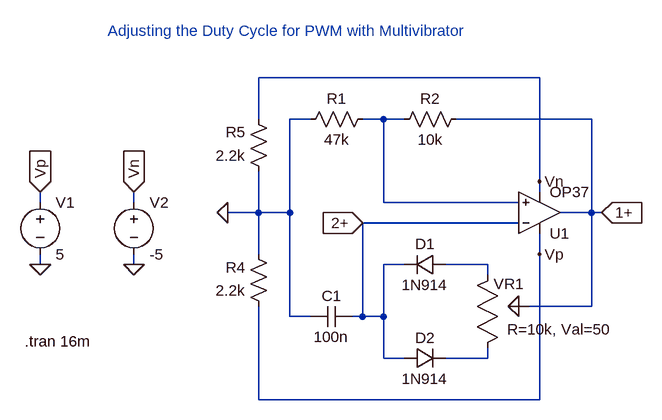
[diagram p0: schematic pwm_dc_multivibr_ltspice.asc]
pwm_dc_multivibr_ltspice.asc, the LTspice schematic file:
Version 4
SHEET 1 932 888
WIRE 400 256 -32 256
WIRE -32 320 -32 256
WIRE 48 320 16 320
WIRE 160 320 128 320
WIRE 192 320 160 320
WIRE 480 320 272 320
WIRE 400 416 400 256
WIRE 400 432 400 416
WIRE -368 448 -368 432
WIRE -224 448 -224 432
WIRE 160 448 160 320
WIRE 368 448 160 448
WIRE -32 464 -32 400
WIRE -32 464 -80 464
WIRE 16 464 16 320
WIRE 16 464 -32 464
WIRE 480 464 480 320
WIRE 480 464 432 464
WIRE 496 464 480 464
WIRE 368 480 128 480
WIRE -32 528 -32 464
WIRE 400 528 400 496
WIRE -368 544 -368 528
WIRE -224 544 -224 528
WIRE 192 544 160 544
WIRE 320 544 256 544
WIRE 320 560 320 544
WIRE 480 608 480 464
WIRE 480 608 384 608
WIRE 16 624 16 464
WIRE 48 624 16 624
WIRE 128 624 128 480
WIRE 128 624 112 624
WIRE 160 624 160 544
WIRE 160 624 128 624
WIRE 160 688 160 624
WIRE 192 688 160 688
WIRE 320 688 320 672
WIRE 320 688 256 688
WIRE -32 752 -32 608
WIRE 400 752 400 528
WIRE 400 752 -32 752
FLAG -368 544 0
FLAG -224 544 0
FLAG -368 432 Vp
IOPIN -368 432 In
FLAG -224 432 Vn
IOPIN -224 432 In
FLAG -80 464 0
FLAG 400 416 Vn
FLAG 400 528 Vp
FLAG 496 464 1+
IOPIN 496 464 In
FLAG 128 480 2+
IOPIN 128 480 In
SYMBOL Opamps\\OP37 400 528 M180
SYMATTR InstName U1
SYMBOL voltage -368 432 R0
WINDOW 123 0 0 Left 0
WINDOW 39 0 0 Left 0
SYMATTR InstName V1
SYMATTR Value 5
SYMBOL voltage -224 432 R0
WINDOW 123 0 0 Left 0
WINDOW 39 0 0 Left 0
SYMATTR InstName V2
SYMATTR Value -5
SYMBOL res 144 304 R90
WINDOW 0 0 56 VBottom 2
WINDOW 3 32 56 VTop 2
SYMATTR InstName R1
SYMATTR Value 47k
SYMBOL res 288 304 R90
WINDOW 0 0 56 VBottom 2
WINDOW 3 32 56 VTop 2
SYMATTR InstName R2
SYMATTR Value 10k
SYMBOL res -16 416 R180
WINDOW 0 36 76 Left 2
WINDOW 3 36 40 Left 2
SYMATTR InstName R5
SYMATTR Value 2.2k
SYMBOL res -16 624 R180
WINDOW 0 36 76 Left 2
WINDOW 3 36 40 Left 2
SYMATTR InstName R4
SYMATTR Value 2.2k
SYMBOL cap 112 608 R90
WINDOW 0 0 32 VBottom 2
WINDOW 3 32 32 VTop 2
SYMATTR InstName C1
SYMATTR Value 100n
SYMBOL diode 256 528 R90
WINDOW 0 0 32 VBottom 2
WINDOW 3 32 32 VTop 2
SYMATTR InstName D1
SYMATTR Value 1N914
SYMBOL diode 192 672 M90
WINDOW 0 0 32 VBottom 2
WINDOW 3 32 32 VTop 2
SYMATTR InstName D2
SYMATTR Value 1N914
SYMBOL potentiometer 336 576 M0
WINDOW 0 -40 -2 Left 2
WINDOW 39 -174 68 Left 2
SYMATTR InstName VR1
SYMATTR SpiceLine R=10k, Val=50
TEXT -264 184 Left 2 ;Adjusting the Duty Cycle for PWM with Multivibrator
TEXT -392 662 Left 2 !.tran 16m

The netlist it stands for:
* pwm_dc_multivibr_ltspice.asc
XU1 N001 2+ Vp Vn 1+ LT1037  ; OP37, pins In+ In- V+ V- OUT
V1 Vp 0 5
V2 Vn 0 -5
R1 N001 0 47k
R2 1+ N001 10k
R5 0 Vn 2.2k
R4 Vp 0 2.2k
C1 2+ 0 100n
D1 N002 2+ 1N914
D2 2+ N003 1N914
XVR1 N002 1+ N003 potentiometer R=10k, Val=50  ; pins 1 2 3
.model D D
.lib standard.dio
* Adjusting the Duty Cycle for PWM with Multivibrator
.tran 16m
.lib LTC.lib
.backanno
.end